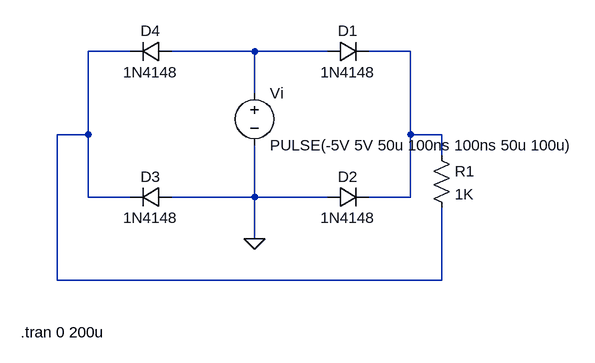
[diagram p0: schematic 1.2.2.asc]
1.2.2.asc, the LTspice schematic file:
Version 4
SHEET 1 880 680
WIRE 128 112 64 112
WIRE 320 112 192 112
WIRE 432 112 320 112
WIRE 560 112 496 112
WIRE 320 176 320 112
WIRE 64 240 64 112
WIRE 64 240 16 240
WIRE 560 240 560 112
WIRE 608 240 560 240
WIRE 608 272 608 240
WIRE 64 336 64 240
WIRE 128 336 64 336
WIRE 320 336 320 256
WIRE 320 336 192 336
WIRE 432 336 320 336
WIRE 560 336 560 240
WIRE 560 336 496 336
WIRE 320 400 320 336
WIRE 16 464 16 240
WIRE 608 464 608 352
WIRE 608 464 16 464
FLAG 320 400 0
SYMBOL diode 432 128 R270
WINDOW 0 32 32 VTop 2
WINDOW 3 0 32 VBottom 2
SYMATTR InstName D1
SYMATTR Value 1N4148
SYMBOL diode 432 352 R270
WINDOW 0 32 32 VTop 2
WINDOW 3 0 32 VBottom 2
SYMATTR InstName D2
SYMATTR Value 1N4148
SYMBOL diode 192 320 R90
WINDOW 0 0 32 VBottom 2
WINDOW 3 32 32 VTop 2
SYMATTR InstName D3
SYMATTR Value 1N4148
SYMBOL diode 192 96 R90
WINDOW 0 0 32 VBottom 2
WINDOW 3 32 32 VTop 2
SYMATTR InstName D4
SYMATTR Value 1N4148
SYMBOL voltage 320 160 R0
WINDOW 123 0 0 Left 0
WINDOW 39 0 0 Left 0
SYMATTR InstName Vi
SYMATTR Value PULSE(-5V 5V 50u 100ns 100ns 50u 100u)
SYMBOL res 592 256 R0
SYMATTR InstName R1
SYMATTR Value 1K
TEXT -40 544 Left 2 !.tran 0 200u

The netlist it stands for:
* 1.2.2.asc
D1 N002 N003 1N4148
D2 0 N003 1N4148
D3 0 N001 1N4148
D4 N002 N001 1N4148
Vi N002 0 PULSE(-5V 5V 50u 100ns 100ns 50u 100u)
R1 N003 N001 1K
.model D D
.lib standard.dio
.tran 0 200u
.backanno
.end